# Altium schematic sheet Resistor - 681-816.SchDoc
size A0; SheetNumber: 12; SheetTotal: 41
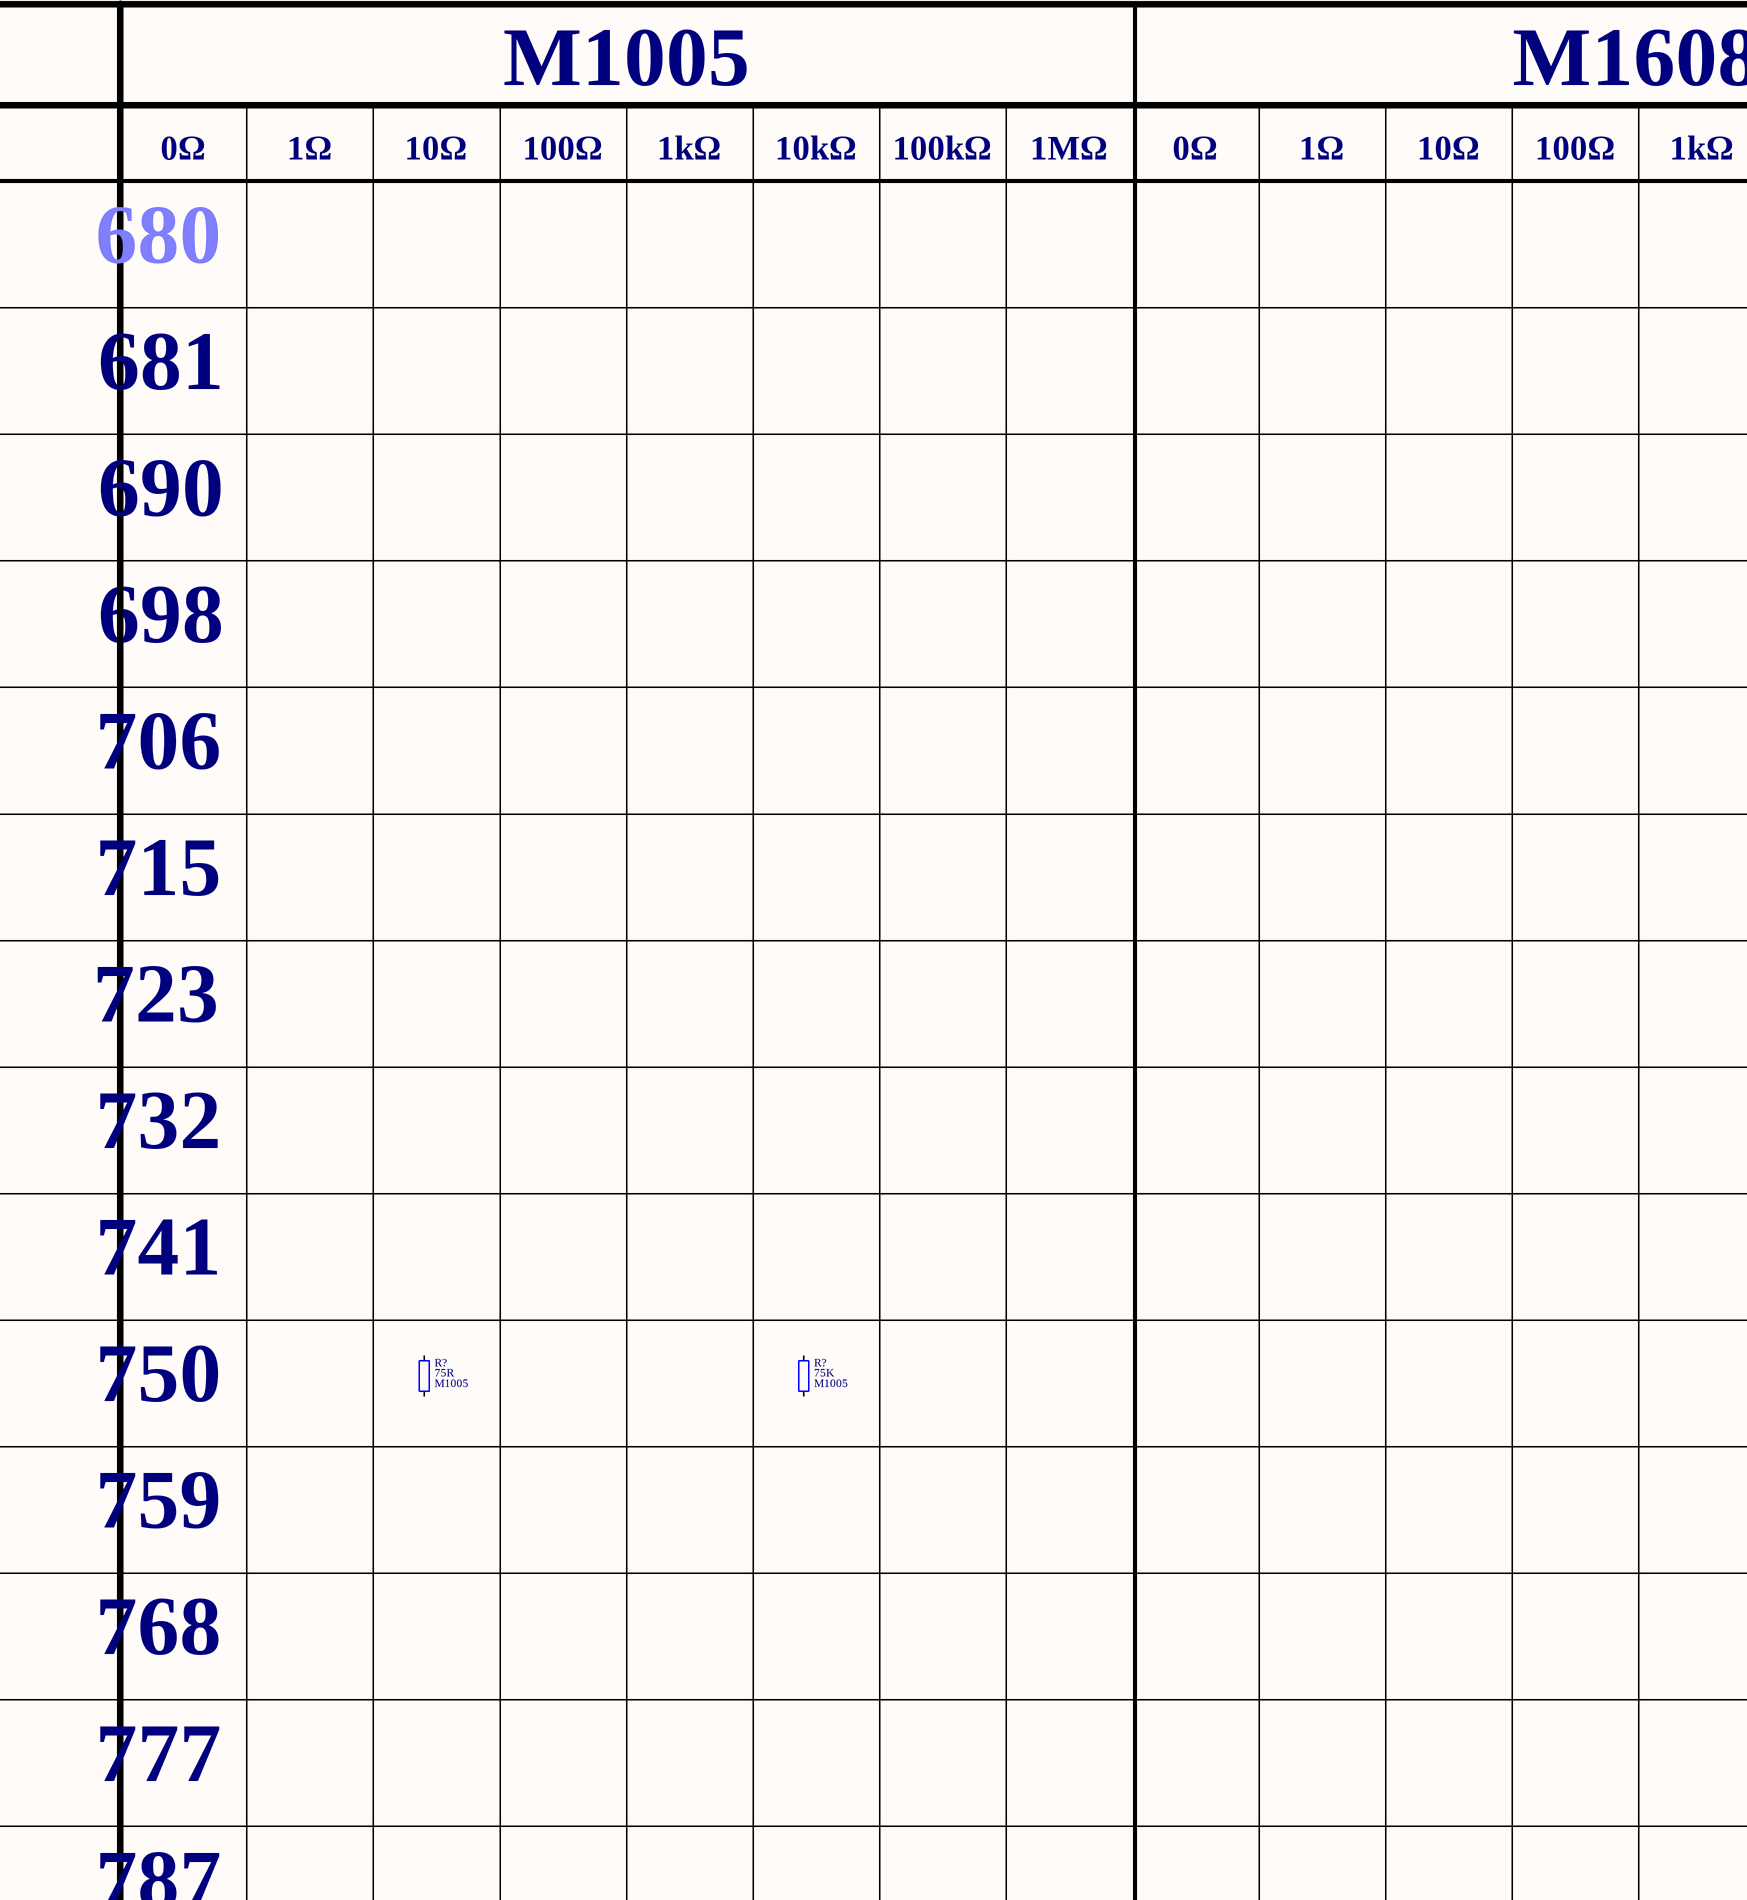
[diagram p0: Resistor - 681-816.SchDoc, top left]
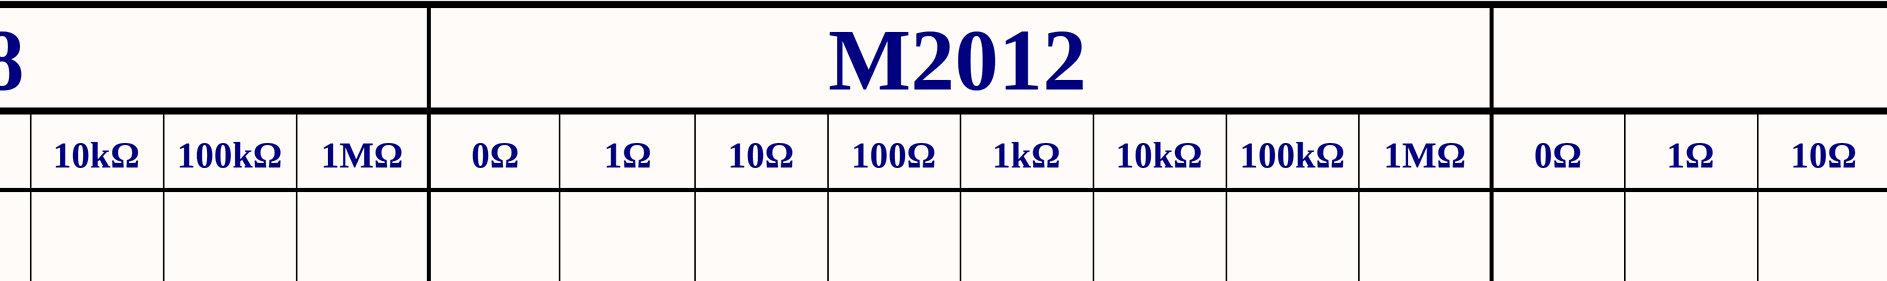
[diagram p1: Resistor - 681-816.SchDoc, top middle]
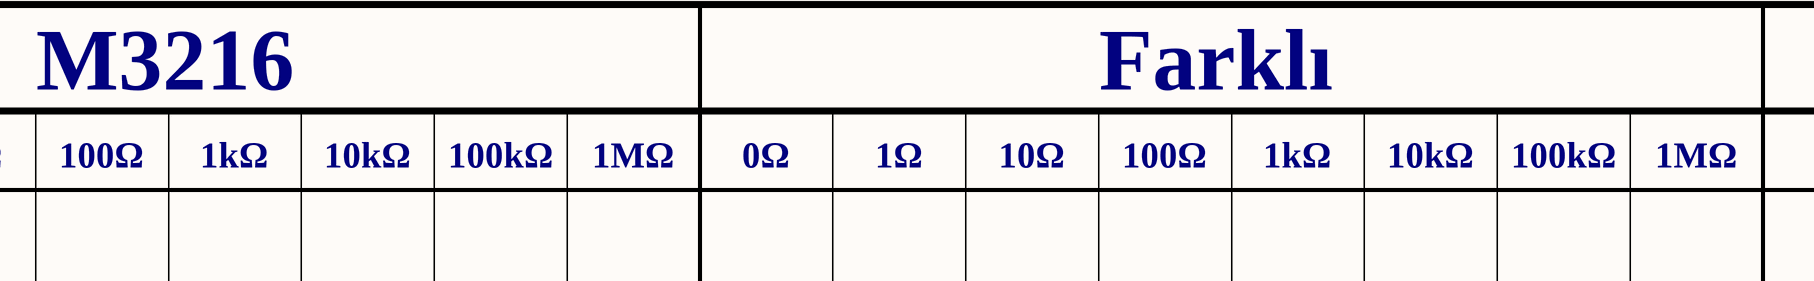
[diagram p2: Resistor - 681-816.SchDoc, top right]
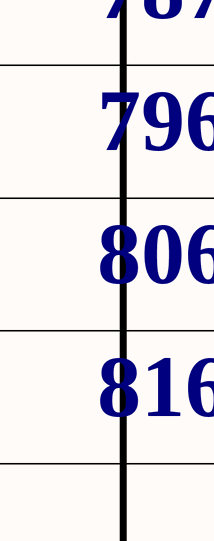
[diagram p3: Resistor - 681-816.SchDoc, bottom left]

## Parts
(Parts that share a designator on the sheet are numbered #1, #2 ... from top to bottom, then left to right.)
R?#1  value 75R  Package: M1005  [Resistor_Smd_M1005_I0402]  (hidden comment: Resistor)
R?#2  value 75K  Package: M1005  [Resistor_Smd_M1005_I0402]  (hidden comment: Resistor)

## Nets

Not connected (* = marked no-connect by the designer): R?#1 1 2; R?#2 1 2

## Notes on the sheet
- M1005
- M1608
- M2012
- M3216
- Farklı
- 0Ω
- 1Ω
- 10Ω
- 100Ω
- 1kΩ
- 10kΩ
- 100kΩ
- 1MΩ
- 680
- 681
- 690
- 698
- 706
- 715
- 723
- 732
- 741
- 750
- 759
- 768
- 777
- 787
- 796
- 806
- 816

## Library data of the parts
R?#1 = Resistor: Res, 75R, 1%, M1005; Manufacturer: Yageo; Manufacturer Part Number: RC0402FR-0775RL; Component Category: Resistor; Component Type: Fixed Value; Tolerance: 1%; Supplier Link: https://www.digikey.com/en/products/detail/yageo/RC0402FR-0775RL/726658; Supplier Currency: $; Price, Max: 0.00129; Price, Min: 0.1; Quantity, Max: 100000; Quantity, Min: 1; Operating Temperature, Max: -55℃; Operating Temperature, Min: +155℃; Supplier Part Number: 311-75.0LRCT-ND; Supplier: Digikey; ComponentLink1Description: Datasheet; ComponentLink1URL: E:\Altium\Datasheets\Resistor\Yageo - RC_L Series.pdf; ComponentLink2Description: Supplier Link; ComponentLink2URL: https://www.digikey.com/en/products/detail/yageo/RC0402FR-0775RL/726658
R?#2 = Resistor: Res, 75K, 1%, M1005; Manufacturer: Yageo; Manufacturer Part Number: RC0402FR-0775KL; Component Category: Resistor; Component Type: Fixed Value; Tolerance: 1%; Supplier Link: https://www.digikey.com/en/products/detail/yageo/RC0402FR-0775KL/2827576; Supplier Currency: $; Price, Max: 0.00129; Price, Min: 0.1; Quantity, Max: 100000; Quantity, Min: 1; Operating Temperature, Max: -55℃; Operating Temperature, Min: +155℃; Supplier Part Number: 311-75KLRCT-ND; Supplier: Digikey; ComponentLink1Description: Datasheet; ComponentLink1URL: E:\Altium\Datasheets\Resistor\Yageo - RC_L Series.pdf; ComponentLink2Description: Supplier Link; ComponentLink2URL: https://www.digikey.com/en/products/detail/yageo/RC0402FR-0775KL/2827576